# EAGLE design motherboard (EAGLE 5.10)
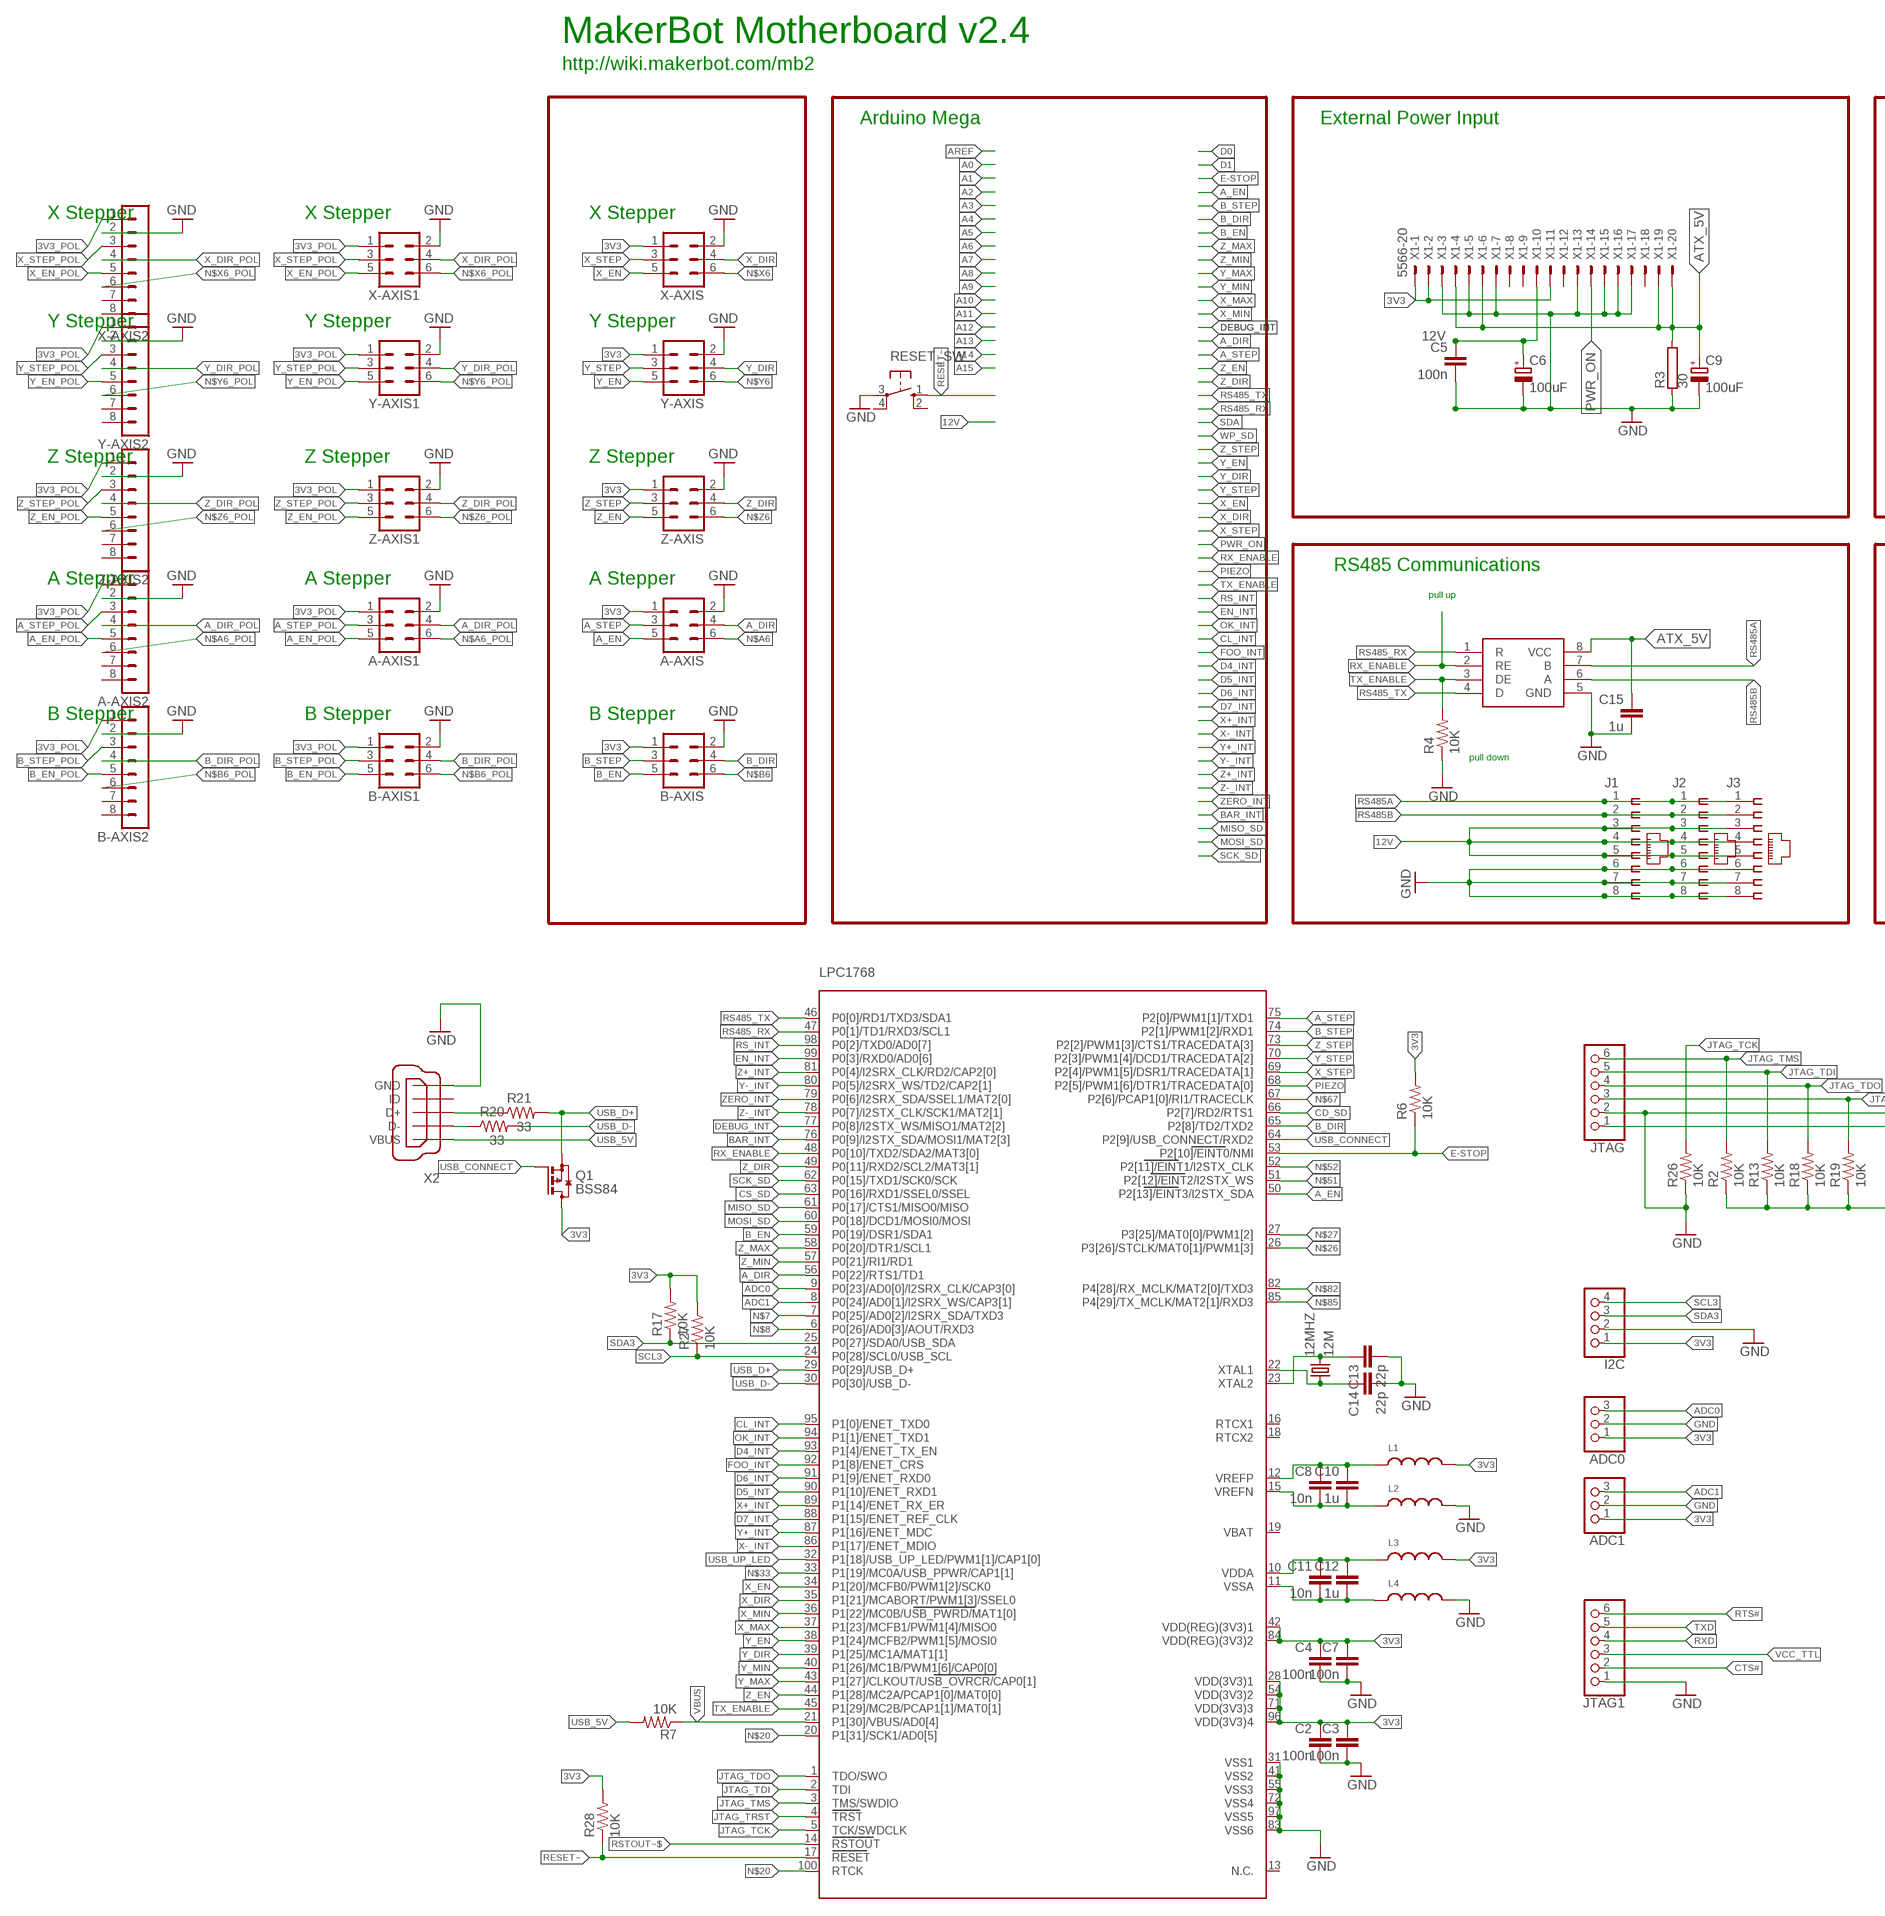
[diagram p0: schematic, sheet 1, part 1 of 2]
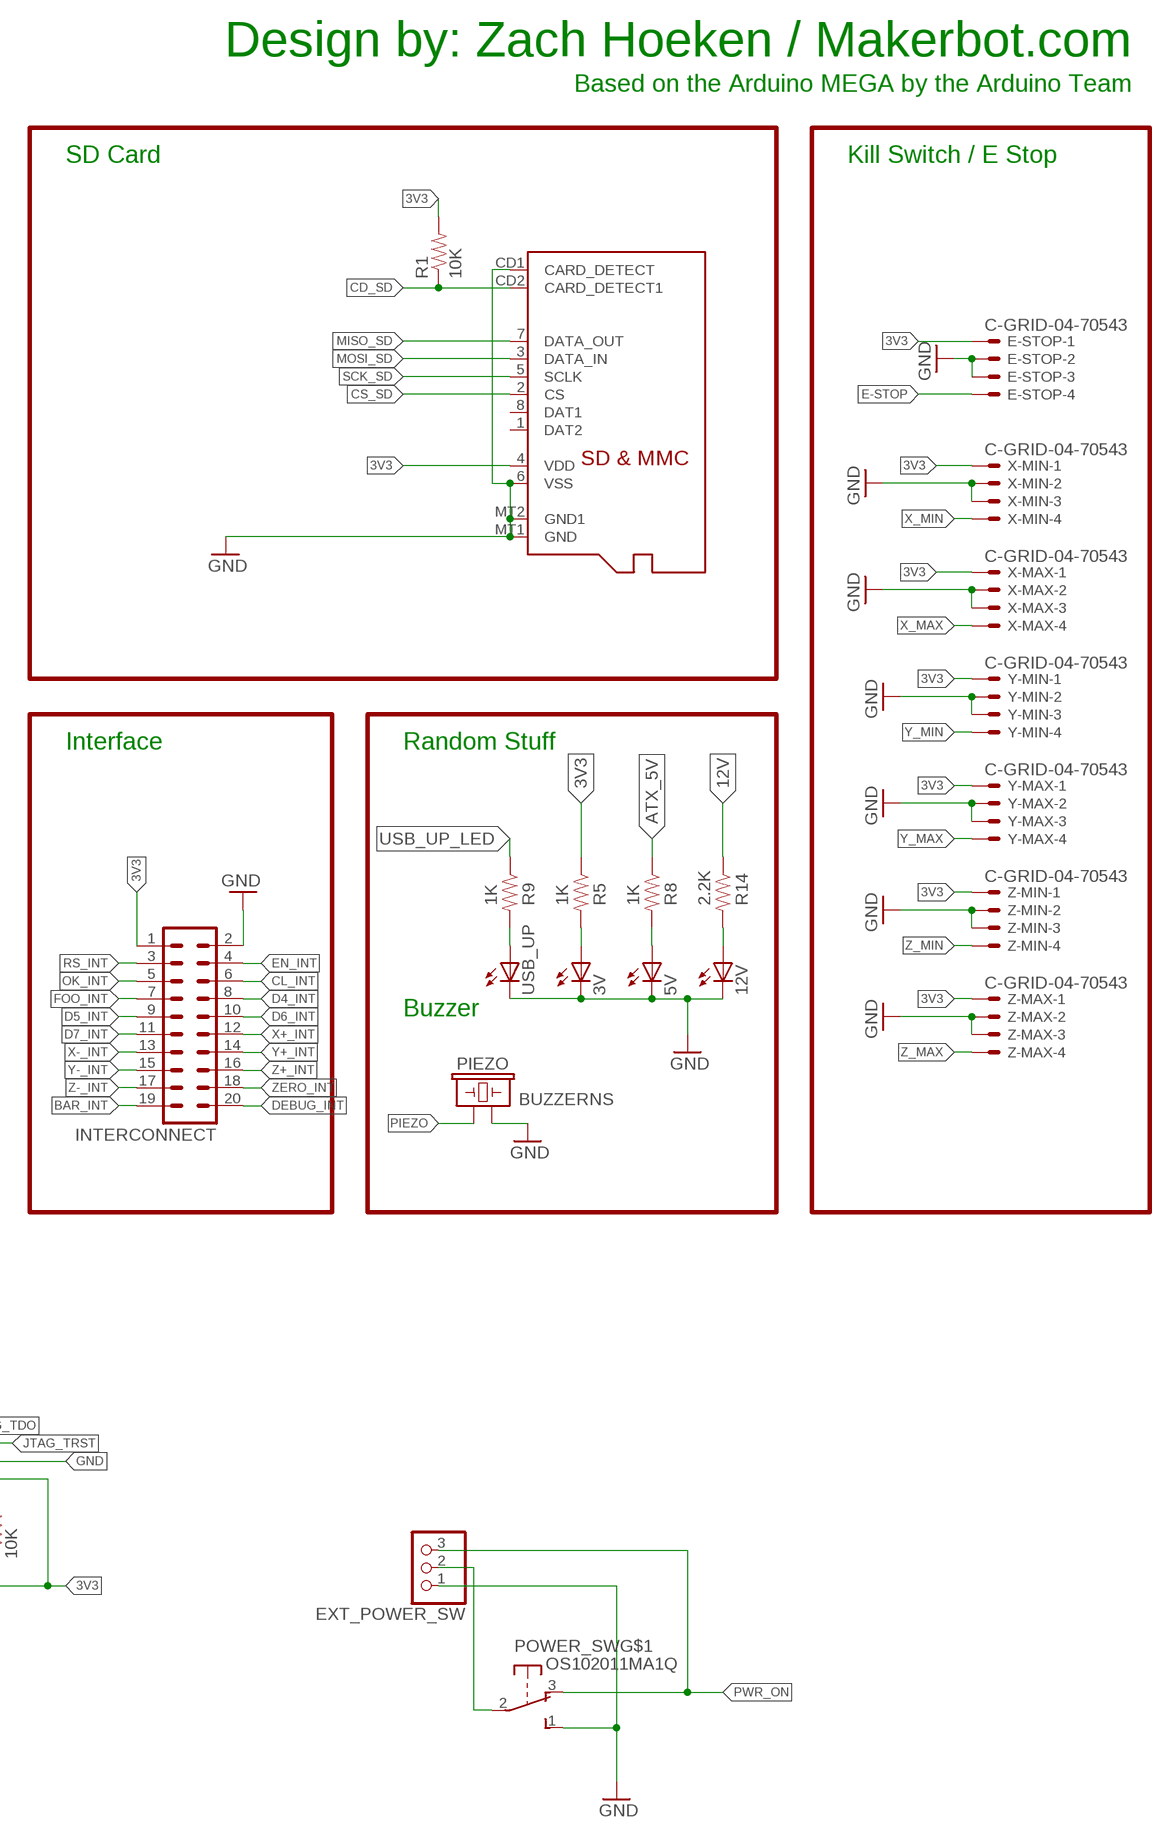
[diagram p1: schematic, sheet 1, part 2 of 2]

## Parts
3V  LED0805  [LED-0805]
5V  LED0805  [LED-0805]
12MHZ  12M  CRYSTALHC49U-V  [HC49U-V]
12V  LED0805  [LED-0805]
A-AXIS  MA03-2  [MA03-2]
A-AXIS1  MA03-2  [MA03-2]
A-AXIS2  MA08-1  [MA08-1]
ADC0  HEADER-1X3ROUND  [1X03_ROUND]
ADC1  HEADER-1X3ROUND  [1X03_ROUND]
B-AXIS  MA03-2  [MA03-2]
B-AXIS1  MA03-2  [MA03-2]
B-AXIS2  MA08-1  [MA08-1]
C2  100n  CAP0805  [0805]
C3  100n  CAP0805  [0805]
C4  100n  CAP0805  [0805]
C5  100n  CAP0805  [0805]
C6  100uF  CPOL-EUE2.5-5  [E2,5-5]
C7  100n  CAP0805  [0805]
C8  10n  CAP0805  [0805]
C9  100uF  CPOL-EUE2.5-5  [E2,5-5]
C10  1u  CAP0805  [0805]
C11  10n  CAP0805  [0805]
C12  1u  CAP0805  [0805]
C13  22p  CAP0805  [0805]
C14  22p  CAP0805  [0805]
C15  1u  CAP0805  [0805]
E-STOP  C-GRID-04-70543  [70543-04]
EXT_POWER_SW  HEADER-1X3ROUND  [1X03_ROUND]
I2C  HEADER-1X4ROUND  [1X04_ROUND]
INTERCONNECT  MA10-2  [MA10-2]
J1  556416-1  [556416-1]
J2  556416-1  [556416-1]
J3  556416-1  [556416-1]
JTAG  HEADER-1X6ROUND  [1X06_ROUND]
JTAG1  HEADER-1X6ROUND  [1X06_ROUND]
L1  INDUCTOR0603  [0603]
L2  INDUCTOR0603  [0603]
L3  INDUCTOR0603  [0603]
L4  INDUCTOR0603  [0603]
LPC1768  LPC1768  [LQFP100]
MICRO_SD  MICROSD  [MICROSD]
PIEZO  BUZZERNS  [BUZZER-12MM-NS]
POWER_SW  OS102011MA1Q  [OS102011MA1Q]
Q1  BSS84  [SOT23]
R1  10K  RESISTOR  [0805]
R2  10K  RESISTOR  [0805]
R3  30  RKH208-8R  [KH208R-8]
R4  10K  RESISTOR  [0805]
R5  1K  RESISTOR  [0805]
R6  10K  RESISTOR  [0805]
R7  10K  RESISTOR  [0805]
R8  1K  RESISTOR  [0805]
R9  1K  RESISTOR  [0805]
R13  10K  RESISTOR  [0805]
R14  2.2K  RESISTOR  [0805]
R17  10K  RESISTOR  [0805]
R18  10K  RESISTOR  [0805]
R19  10K  RESISTOR  [0805]
R20  33  RESISTOR  [0805]
R21  33  RESISTOR  [0805]
R26  10K  RESISTOR  [0805]
R27  10K  RESISTOR  [0805]
R28  10K  RESISTOR  [0805]
RESET_SW  10-XX  [B3F-10XX]
RS244  SN75176ASOIC  [SO08]
USB_UP  LED0805  [LED-0805]
X1  5566-20  [5566-20]
X2  MINI-USB_SHIELD5P2-32005-601  [32005-601]
X-AXIS  MA03-2  [MA03-2]
X-AXIS1  MA03-2  [MA03-2]
X-AXIS2  MA08-1  [MA08-1]
X-MAX  C-GRID-04-70543  [70543-04]
X-MIN  C-GRID-04-70543  [70543-04]
Y-AXIS  MA03-2  [MA03-2]
Y-AXIS1  MA03-2  [MA03-2]
Y-AXIS2  MA08-1  [MA08-1]
Y-MAX  C-GRID-04-70543  [70543-04]
Y-MIN  C-GRID-04-70543  [70543-04]
Z-AXIS  MA03-2  [MA03-2]
Z-AXIS1  MA03-2  [MA03-2]
Z-AXIS2  MA08-1  [MA08-1]
Z-MAX  C-GRID-04-70543  [70543-04]
Z-MIN  C-GRID-04-70543  [70543-04]

## Nets
3V3: A-AXIS.1 ADC0.1 ADC1.1 B-AXIS.1 C2.1 C3.1 C4.1 C7.1 E-STOP.1 I2C.1 INTERCONNECT.1 JTAG.1 L1.2 L3.2 LPC1768.28(VDD(3V3)1) LPC1768.42(VDD(REG)(3V3)1) LPC1768.54(VDD(3V3)2) LPC1768.71(VDD(3V3)3) LPC1768.84(VDD(REG)(3V3)2) LPC1768.96(VDD(3V3)4) MICRO_SD.4(VDD) Q1.3(D) R1.2 R2.1 R5.1 R6.2 R13.1 R17.2 R18.1 R19.1 R27.2 R28.2 X1.1 X1.2 X1.11 X-AXIS.1 X-MAX.1 X-MIN.1 Y-AXIS.1 Y-MAX.1 Y-MIN.1 Z-AXIS.1 Z-MAX.1 Z-MIN.1
3V3_POL: A-AXIS1.1 A-AXIS2.1 B-AXIS1.1 B-AXIS2.1 X-AXIS1.1 X-AXIS2.1 Y-AXIS1.1 Y-AXIS2.1 Z-AXIS1.1 Z-AXIS2.1
12V [12v]: C5.1 C6.+ J1.3 J1.4 J1.5 J2.3 J2.4 J2.5 J3.3 J3.4 J3.5 R14.1 X1.10
A_DIR: A-AXIS.4 LPC1768.56(P0[22]/RTS1/TD1)
A_DIR_POL: A-AXIS1.4 A-AXIS2.4
A_EN: A-AXIS.5 LPC1768.50(P2[13]/EINT3/I2STX_SDA)
A_EN_POL: A-AXIS1.5 A-AXIS2.5
A_STEP: A-AXIS.3 LPC1768.75(P2[0]/PWM1[1]/TXD1)
A_STEP_POL: A-AXIS1.3 A-AXIS2.3
ADC0: ADC0.3 LPC1768.9(P0[23]/AD0[0]/I2SRX_CLK/CAP3[0])
ADC1: ADC1.3 LPC1768.8(P0[24]/AD0[1]/I2SRX_WS/CAP3[1])
ATX_5V [power]: C9.+ C15.1 R3.2 R8.1 RS244.8(VCC) X1.4 X1.6 X1.19 X1.20
B_DIR: B-AXIS.4 LPC1768.65(P2[8]/TD2/TXD2)
B_DIR_POL: B-AXIS1.4 B-AXIS2.4
B_EN: B-AXIS.5 LPC1768.59(P0[19]/DSR1/SDA1)
B_EN_POL: B-AXIS1.5 B-AXIS2.5
B_STEP: B-AXIS.3 LPC1768.74(P2[1]/PWM1[2]/RXD1)
B_STEP_POL: B-AXIS1.3 B-AXIS2.3
BAR_INT: INTERCONNECT.19 LPC1768.76(P0[9]/I2STX_SDA/MOSI1/MAT2[3])
CD_SD: LPC1768.66(P2[7]/RD2/RTS1) MICRO_SD.CD2(CARD_DETECT1) R1.1
CL_INT: INTERCONNECT.6 LPC1768.95(P1[0]/ENET_TXD0)
CS_SD: LPC1768.63(P0[16]/RXD1/SSEL0/SSEL) MICRO_SD.2(CS)
CTS#: JTAG1.2
D4_INT: INTERCONNECT.8 LPC1768.93(P1[4]/ENET_TX_EN)
D5_INT: INTERCONNECT.9 LPC1768.90(P1[10]/ENET_RXD1)
D6_INT: INTERCONNECT.10 LPC1768.91(P1[9]/ENET_RXD0)
D7_INT: INTERCONNECT.11 LPC1768.88(P1[15]/ENET_REF_CLK)
DEBUG_INT: INTERCONNECT.20 LPC1768.77(P0[8]/I2STX_WS/MISO1/MAT2[2])
E-STOP: E-STOP.4 LPC1768.53(P2[10]/EINT0/NMI) R6.1
EN_INT: INTERCONNECT.4 LPC1768.99(P0[3]/RXD0/AD0[6])
FOO_INT: INTERCONNECT.7 LPC1768.92(P1[8]/ENET_CRS)
GND [gnd]: 3V.C 5V.C 12V.C A-AXIS.2 ADC0.2 ADC1.2 B-AXIS.2 C2.2 C3.2 C4.2 C5.2 C6.- C7.2 C9.- C13.2 C14.2 C15.2 E-STOP.2 E-STOP.3 EXT_POWER_SW.1 I2C.2 INTERCONNECT.2 J1.6 J1.7 J1.8 J2.6 J2.7 J2.8 J3.6 J3.7 J3.8 JTAG1.1 JTAG.2 L2.2 L4.2 LPC1768.31(VSS1) LPC1768.41(VSS2) LPC1768.55(VSS3) LPC1768.72(VSS4) LPC1768.83(VSS6) LPC1768.97(VSS5) MICRO_SD.6(VSS) MICRO_SD.CD1(CARD_DETECT) MICRO_SD.MT1(GND) MICRO_SD.MT2(GND1) PIEZO.- POWER_SW.1(S) R3.1 R4.1 R26.1 RESET_SW.3(P) RS244.5(GND) USB_UP.C X1.3 X1.5 X1.7 X1.13 X1.15 X1.16 X1.17 X2.5(GND) X-AXIS.2 X-MAX.2 X-MAX.3 X-MIN.2 X-MIN.3 Y-AXIS.2 Y-MAX.2 Y-MAX.3 Y-MIN.2 Y-MIN.3 Z-AXIS.2 Z-MAX.2 Z-MAX.3 Z-MIN.2 Z-MIN.3
GND_POL [gnd]: A-AXIS1.2 A-AXIS2.2 B-AXIS1.2 B-AXIS2.2 X-AXIS1.2 X-AXIS2.2 Y-AXIS1.2 Y-AXIS2.2 Z-AXIS1.2 Z-AXIS2.2 ; supply symbol labelled GND
JTAG_TCK: LPC1768.5(TCK/SWDCLK) R26.2
JTAG_TDI: JTAG.5 LPC1768.2(TDI) R13.2
JTAG_TDO: JTAG.4 LPC1768.1(TDO/SWO) R18.2
JTAG_TMS: JTAG.6 LPC1768.3(TMS/SWDIO) R2.2
JTAG_TRST: JTAG.3 LPC1768.4(TRST) R19.2
MISO_SD: LPC1768.61(P0[17]/CTS1/MISO0/MISO) MICRO_SD.7(DATA_OUT)
MOSI_SD: LPC1768.60(P0[18]/DCD1/MOSI0/MOSI) MICRO_SD.3(DATA_IN)
N$1: 3V.A R5.2
N$2: R9.2 USB_UP.A
N$3: 5V.A R8.2
N$4: EXT_POWER_SW.2 POWER_SW.2(P)
N$7: LPC1768.7(P0[25]/AD0[2]/I2SRX_SDA/TXD3)
N$8: LPC1768.6(P0[26]/AD0[3]/AOUT/RXD3)
N$10: 12V.A R14.2
N$20: LPC1768.20(P1[31]/SCK1/AD0[5]) LPC1768.100(RTCK)
N$26: LPC1768.26(P3[26]/STCLK/MAT0[1]/PWM1[3])
N$27: LPC1768.27(P3[25]/MAT0[0]/PWM1[2])
N$31: C8.1 C10.1 L1.1 LPC1768.12(VREFP)
N$32: C8.2 C10.2 L2.1 LPC1768.15(VREFN)
N$33: LPC1768.33(P1[19]/MC0A/USB_PPWR/CAP1[1])
N$35: C11.1 C12.1 L3.1 LPC1768.10(VDDA)
N$38: C11.2 C12.2 L4.1 LPC1768.11(VSSA)
N$51: LPC1768.51(P2[12]/EINT2/I2STX_WS)
N$52: LPC1768.52(P2[11]/EINT1/I2STX_CLK)
N$67: LPC1768.67(P2[6]/PCAP1[0]/RI1/TRACECLK)
N$82: LPC1768.82(P4[28]/RX_MCLK/MAT2[0]/TXD3)
N$85: LPC1768.85(P4[29]/TX_MCLK/MAT2[1]/RXD3)
N$A6: A-AXIS.6
N$A6_POL: A-AXIS1.6 A-AXIS2.6
N$B6: B-AXIS.6
N$B6_POL: B-AXIS1.6 B-AXIS2.6
N$X6: X-AXIS.6
N$X6_POL: X-AXIS1.6 X-AXIS2.6
N$Y6: Y-AXIS.6
N$Y6_POL: Y-AXIS1.6 Y-AXIS2.6
N$Z6: Z-AXIS.6
N$Z6_POL: Z-AXIS1.6 Z-AXIS2.6
OK_INT: INTERCONNECT.5 LPC1768.94(P1[1]/ENET_TXD1)
PIEZO: LPC1768.68(P2[5]/PWM1[6]/DTR1/TRACEDATA[0]) PIEZO.+
PWR_ON: EXT_POWER_SW.3 POWER_SW.3(O) X1.14
RESET~: LPC1768.17(RESET) R28.1 RESET_SW.1(S)
RS485_RX: LPC1768.47(P0[1]/TD1/RXD3/SCL1) RS244.1(R)
RS485_TX: LPC1768.46(P0[0]/RD1/TXD3/SDA1) RS244.4(D)
RS485A: J1.1 J2.1 J3.1 RS244.7(B)
RS485B: J1.2 J2.2 J3.2 RS244.6(A)
RS_INT: INTERCONNECT.3 LPC1768.98(P0[2]/TXD0/AD0[7])
RSTOUT~$: LPC1768.14(RSTOUT)
RTS#: JTAG1.6
RX_ENABLE: LPC1768.48(P0[10]/TXD2/SDA2/MAT3[0]) RS244.2(RE)
RXD: JTAG1.4
SCK_SD: LPC1768.62(P0[15]/TXD1/SCK0/SCK) MICRO_SD.5(SCLK)
SCL3: I2C.4 LPC1768.24(P0[28]/SCL0/USB_SCL) R27.1
SDA3: I2C.3 LPC1768.25(P0[27]/SDA0/USB_SDA) R17.1
TX_ENABLE: LPC1768.45(P1[29]/MC2B/PCAP1[1]/MAT0[1]) R4.2 RS244.3(DE)
TXD: JTAG1.5
USB_5V [12v]: R7.2 X2.1(VBUS)
USB_CONNECT: LPC1768.64(P2[9]/USB_CONNECT/RXD2) Q1.1(G)
USB_D+: LPC1768.29(P0[29]/USB_D+) Q1.2(S) R21.2
USB_D+_CON: R21.1 X2.3(D+)
USB_D-: LPC1768.30(P0[30]/USB_D-) R20.2
USB_D-_CON: R20.1 X2.2(D-)
USB_UP_LED: LPC1768.32(P1[18]/USB_UP_LED/PWM1[1]/CAP1[0]) R9.1
VBUS: LPC1768.21(P1[30]/VBUS/AD0[4]) R7.1
VCC_TTL: JTAG1.3
X+_INT: INTERCONNECT.12 LPC1768.89(P1[14]/ENET_RX_ER)
X-_INT: INTERCONNECT.13 LPC1768.86(P1[17]/ENET_MDIO)
X_DIR: LPC1768.35(P1[21]/MCABORT/PWM1[3]/SSEL0) X-AXIS.4
X_DIR_POL: X-AXIS1.4 X-AXIS2.4
X_EN: LPC1768.34(P1[20]/MCFB0/PWM1[2]/SCK0) X-AXIS.5
X_EN_POL: X-AXIS1.5 X-AXIS2.5
X_MAX: LPC1768.37(P1[23]/MCFB1/PWM1[4]/MISO0) X-MAX.4
X_MIN: LPC1768.36(P1[22]/MC0B/USB_PWRD/MAT1[0]) X-MIN.4
X_STEP: LPC1768.69(P2[4]/PWM1[5]/DSR1/TRACEDATA[1]) X-AXIS.3
X_STEP_POL: X-AXIS1.3 X-AXIS2.3
XTAL1: 12MHZ.1 C14.1 LPC1768.22(XTAL1)
XTAL2: 12MHZ.2 C13.1 LPC1768.23(XTAL2)
Y+_INT: INTERCONNECT.14 LPC1768.87(P1[16]/ENET_MDC)
Y-_INT: INTERCONNECT.15 LPC1768.80(P0[5]/I2SRX_WS/TD2/CAP2[1])
Y_DIR: LPC1768.39(P1[25]/MC1A/MAT1[1]) Y-AXIS.4
Y_DIR_POL: Y-AXIS1.4 Y-AXIS2.4
Y_EN: LPC1768.38(P1[24]/MCFB2/PWM1[5]/MOSI0) Y-AXIS.5
Y_EN_POL: Y-AXIS1.5 Y-AXIS2.5
Y_MAX: LPC1768.43(P1[27]/CLKOUT/USB_OVRCR/CAP0[1]) Y-MAX.4
Y_MIN: LPC1768.40(P1[26]/MC1B/PWM1[6]/CAP0[0]) Y-MIN.4
Y_STEP: LPC1768.70(P2[3]/PWM1[4]/DCD1/TRACEDATA[2]) Y-AXIS.3
Y_STEP_POL: Y-AXIS1.3 Y-AXIS2.3
Z+_INT: INTERCONNECT.16 LPC1768.81(P0[4]/I2SRX_CLK/RD2/CAP2[0])
Z-_INT: INTERCONNECT.17 LPC1768.78(P0[7]/I2STX_CLK/SCK1/MAT2[1])
Z_DIR: LPC1768.49(P0[11]/RXD2/SCL2/MAT3[1]) Z-AXIS.4
Z_DIR_POL: Z-AXIS1.4 Z-AXIS2.4
Z_EN: LPC1768.44(P1[28]/MC2A/PCAP1[0]/MAT0[0]) Z-AXIS.5
Z_EN_POL: Z-AXIS1.5 Z-AXIS2.5
Z_MAX: LPC1768.58(P0[20]/DTR1/SCL1) Z-MAX.4
Z_MIN: LPC1768.57(P0[21]/RI1/RD1) Z-MIN.4
Z_STEP: LPC1768.73(P2[2]/PWM1[3]/CTS1/TRACEDATA[3]) Z-AXIS.3
Z_STEP_POL: Z-AXIS1.3 Z-AXIS2.3
ZERO_INT: INTERCONNECT.18 LPC1768.79(P0[6]/I2SRX_SDA/SSEL1/MAT2[0])
Unconnected: A-AXIS2.7 A-AXIS2.8 B-AXIS2.7 B-AXIS2.8 LPC1768.13(N.C.) LPC1768.16(RTCX1) LPC1768.18(RTCX2) LPC1768.19(VBAT) MICRO_SD.1(DAT2) MICRO_SD.8(DAT1) POWER_SW.MT1(MT) POWER_SW.MT2(MT) RESET_SW.2(S1) RESET_SW.4(P1) X1.8 X1.9 X1.12 X1.18 X2.4(ID) X2.M1(S1) X2.M2(S2) X-AXIS2.7 X-AXIS2.8 Y-AXIS2.7 Y-AXIS2.8 Z-AXIS2.7 Z-AXIS2.8

## Notes on the sheet
- Design by: Zach Hoeken / Makerbot.com
- MakerBot Motherboard v2.4
- Based on the Arduino MEGA by the Arduino Team
- http://wiki.makerbot.com/mb2
- Arduino Mega | External Power Input | SD Card | Kill Switch / E Stop
- X Stepper | X Stepper | X Stepper
- Y Stepper | Y Stepper | Y Stepper
- Z Stepper | Z Stepper | Z Stepper
- RS485 Communications | Interface | Random Stuff
- A Stepper | A Stepper | A Stepper
- pull up
- B Stepper | B Stepper | B Stepper
- pull down
- Buzzer

## Library data of the parts
3V 5V 12V USB_UP = SparkFun:LED: LEDs Standard schematic elements and footprints for 5mm, 3mm, 1206, and 0603 sized LEDs. 5mm - Spark Fun Electronics SKU : COM-00529 (and others)
12MHZ = crystal:CRYSTAL: CRYSTAL; OC_FARNELL: 1666969; OC_NEWARK: unknown
A-AXIS A-AXIS1 B-AXIS B-AXIS1 X-AXIS X-AXIS1 Y-AXIS Y-AXIS1 Z-AXIS Z-AXIS1 = con-lstb:MA03-2: PIN HEADER; OC_FARNELL: unknown; OC_NEWARK: unknown
A-AXIS2 B-AXIS2 X-AXIS2 Y-AXIS2 Z-AXIS2 = con-lstb:MA08-1: PIN HEADER; OC_FARNELL: unknown; OC_NEWARK: unknown
ADC0 ADC1 EXT_POWER_SW = microbuilder:HEADER-1X3: PIN HEADER
C2-C5 C7 C8 C10-C15 = SparkFun:CAP: Capacitor Standard 0603 ceramic capacitor, and 0.1" leaded capacitor.
C6 C9 = resistor:CPOL-EU: POLARIZED CAPACITOR, European symbol
E-STOP X-MAX X-MIN Y-MAX Y-MIN Z-MAX Z-MIN = con-molex:C-GRID-04: CONNECTOR wire to board 2.54 mm (0.100") pitch header; OC_FARNELL: unknown; OC_NEWARK: unknown
I2C = microbuilder:HEADER-1X4: PIN HEADER
INTERCONNECT = con-lstb:MA10-2: PIN HEADER; OC_FARNELL: unknown; OC_NEWARK: unknown
J1-J3 = con-amp:556416-1: AMP connector; MF: TYCO ELECTRONICS; MPN: 5556416-1; OC_FARNELL: 1087508; OC_NEWARK: 42K7302
JTAG JTAG1 = microbuilder:HEADER-1X6: PIN HEADER
L1-L4 = microbuilder:INDUCTOR: Inductors 0603: 10nH Ceramic Inductor - microwire antenna/RF (Digikey: 712-1434-2-ND) 0805: 560nH Ceramic Inductor - RF (Digikey: 553-1047-1-ND) 1007 (2518 Metric) SMT: 10µH 10% 250mOhm 820mA 1007 Inductor (Digikey: 587-2189-1-ND) 22µH 10% 500mOhm 580mA 1007 Inductor (Digikey: 587-2190-1-ND) 47µH 10% 950mOhm 420mA 1007 Inductor (Digikey: 587-2191-1-ND) 47µH 5% 100mOhm 1A 1008 Inductor (Digikey: 732-1816-1-ND)
LPC1768 = microbuilder:LPC1768: LPC1768 100 MHz 32-bit ARM Cortex-M3 based microcontroller featuring a high level of integration and low power consumption. 512 kB Flash, 64 kB SRAM, USB Device/Host/OTG, Ethernet, CAN, I2S, 10-bit DAC Digikey: 568-4796-ND
MICRO_SD = adafruit:MICROSD: Micro-SD / Transflash card holder with SPI pinout For the 3M # 2908-05WB-MG and/or 4UCON #19656 push-push type
PIEZO = SparkFun:BUZZER: Buzzer 12mm Spark Fun Electronics SKU : Comp-Buzzer
POWER_SW = adafruit:OS102011MA1Q: OS10201MA1Q through-hole right angle switch http://www.ladyada.net/library/eagle
Q1 = transistor-small-signal:BSS84: P-CHANNEL MOS FET
R1 R2 R4-R9 R13 R14 R17-R21 R26-R28 = SparkFun:RESISTOR: Resistor Basic schematic elements and footprints for 0603, 1206, and PTH 1/10th watt (small) resistors.
R3 = resistor-power:R: Power Resitor
RESET_SW = switch-omron:10-XX: OMRON SWITCH; MPN: B3F-1000; OC_FARNELL: 176432; OC_NEWARK: 36M3542
RS244 = reprap:SN75176A
X1 = con-molex:5566-20: Mini FIT connector 20 pol ATX PC-Motherboard Power connector Source: http://www.molex.com; OC_FARNELL: unknown; OC_NEWARK: unknown
X2 = con-cypressindustries:MINI-USB_SHIELD5P2-: MINI USB-B R/A DIP 5pol. Source: www.cypressindustries.com; OC_FARNELL: unknown; OC_NEWARK: unknown

## Net classes
0 default: width 0.203 mm, drill 0.508 mm, clearance 0.203 mm
1 power: width 0.508 mm, drill 0.508 mm, clearance 0.203 mm
2 gnd: width 0.305 mm, drill 0.508 mm, clearance 0.203 mm
3 12v: width 1.016 mm, drill 0.711 mm, clearance 0.203 mm

## Board
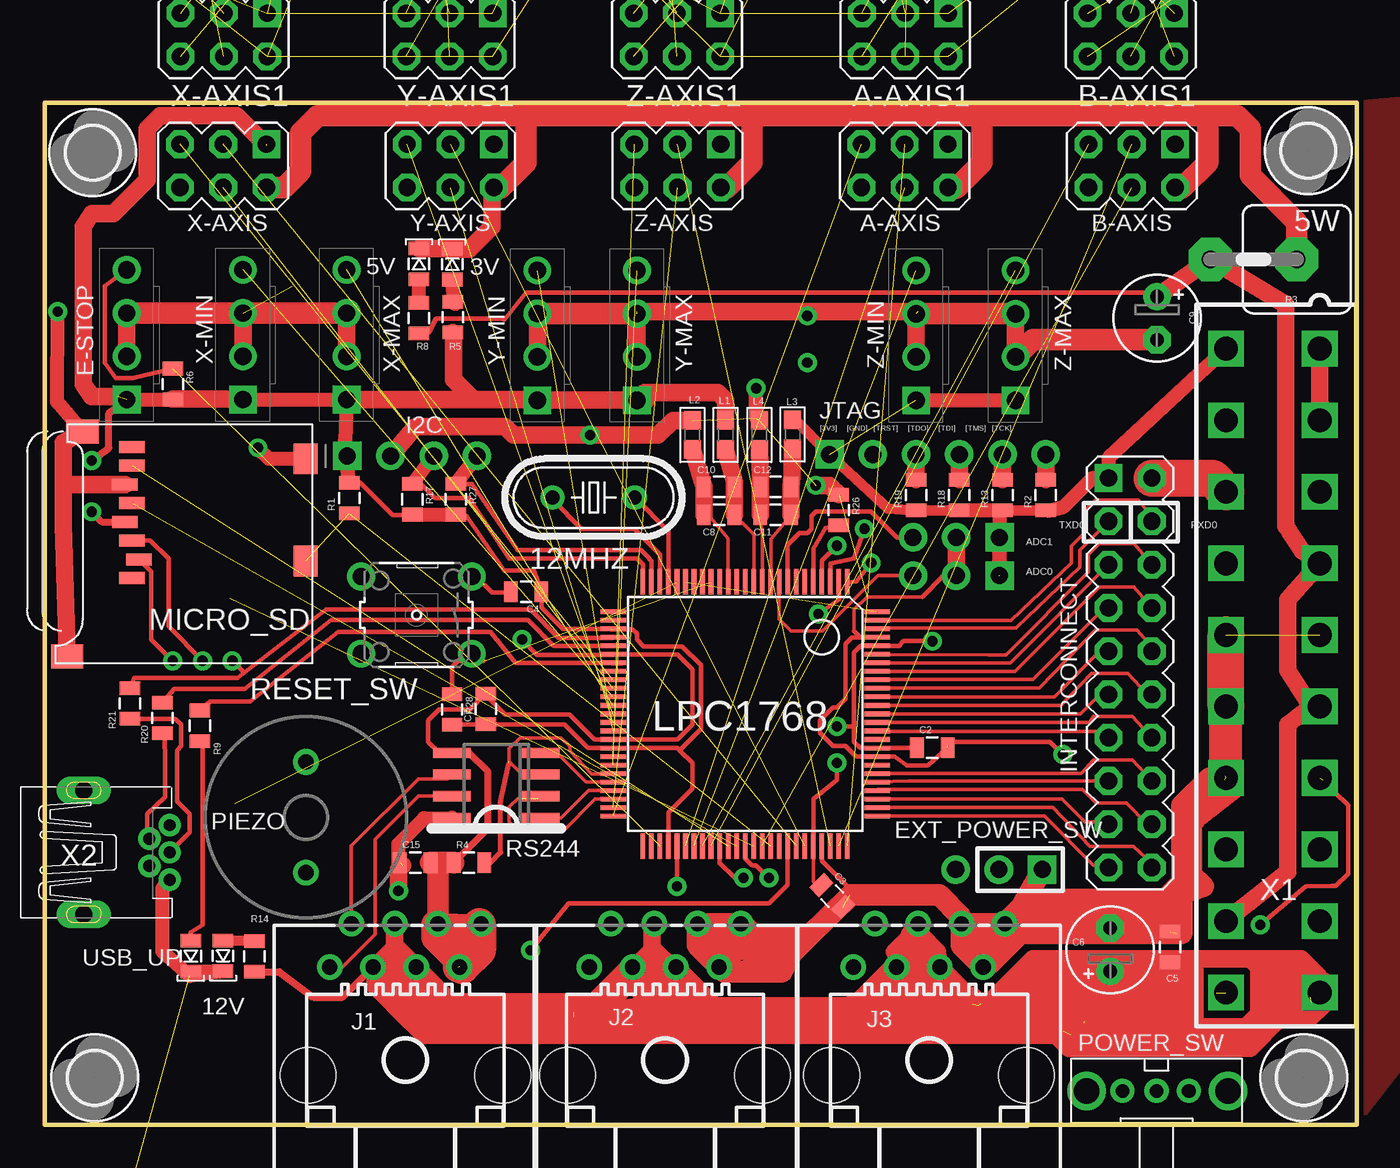
[diagram p2: board, top side]
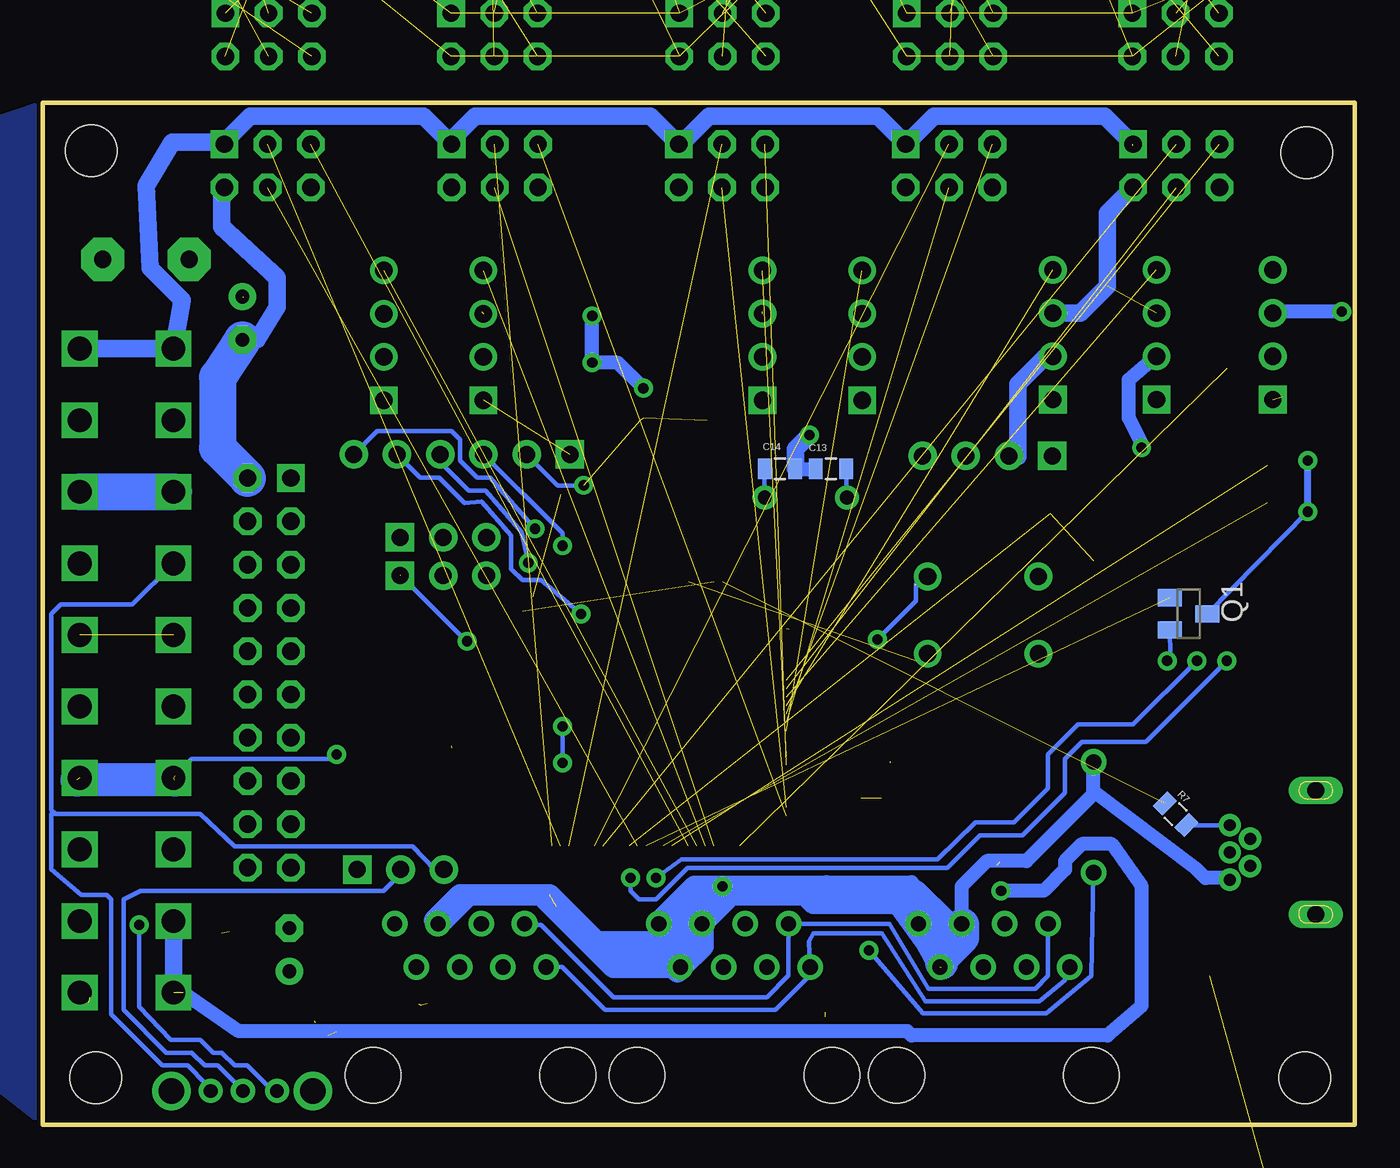
[diagram p3: board, bottom side, seen from below]

Size 77 x 60 mm. Coordinates in mm from the lower left corner, seen from the top.
Outline: 0,60 77,60 77,0 0,0 0,60
Copper layers (1*16): Top 0.035mm / dielectric 1.53mm / Bottom 0.035mm
Design rules "SparkFun *": minimum track width 8mil, minimum drill 0.4mm, track to track 8mil, track to pad 8mil, pad to pad 8mil, via to via 8mil, smd to smd 8mil, copper to edge 10mil, drill to drill 8mil, minimum pad ring 12mil, minimum via ring 10mil, stop-mask expansion 4mil, vias tented up to drill 25mil, thermal gap 10mil

### Footprints (pad centres in the part's own frame; a part is rotated, then mirrored left to right if it is on the bottom)
LED-0805 = smd 1.2 x 0.8: A 0,-0.9; C 0,0.9
HC49U-V = drill 0.813 round: 1 -2.413,0; 2 2.413,0
MA03-2 = drill 1.016 square: 1 -2.54,-1.27 | drill 1.016 octagon: 2 -2.54,1.27; 3 0,-1.27; 4 0,1.27; 5 2.54,-1.27; 6 2.54,1.27
MA08-1 = drill 1.016 long: 1 -8.89,0; 2 -6.35,0; 3 -3.81,0; 4 -1.27,0; 5 1.27,0; 6 3.81,0; 7 6.35,0; 8 8.89,0
1X03_ROUND = drill 1 pad 1.676 square: 1 -2.54,0 | drill 1 pad 1.676 round: 2 0,0; 3 2.54,0
0805 = smd 0.8 x 1.2: 1 -0.9,0; 2 0.9,0
E2,5-5 = drill 0.813 pad 1.6 round: + -1.27,0 | drill 0.813 pad 1.6 octagon: - 1.27,0
70543-04 = drill 1.016 square: 1 -3.81,0 | drill 1.016 round: 2 -1.27,0; 3 1.27,0; 4 3.81,0
1X04_ROUND = drill 1 pad 1.676 square: 1 -3.81,0 | drill 1 pad 1.676 round: 2 -1.27,0; 3 1.27,0; 4 3.81,0
MA10-2 = drill 1.016 square: 1 -11.43,-1.27 | drill 1.016 octagon: 2 -11.43,1.27; 3 -8.89,-1.27; 4 -8.89,1.27; 5 -6.35,-1.27; 6 -6.35,1.27; 7 -3.81,-1.27; 8 -3.81,1.27; 9 -1.27,-1.27; 10 -1.27,1.27; 11 1.27,-1.27; 12 1.27,1.27; 13 3.81,-1.27; 14 3.81,1.27; 15 6.35,-1.27; 16 6.35,1.27; 17 8.89,-1.27; 18 8.89,1.27; 19 11.43,-1.27; 20 11.43,1.27
556416-1 = drill 0.889 round: 1 -4.445,5.461; 2 -3.175,8.001; 3 -1.905,5.461; 4 -0.635,8.001; 5 0.635,5.461; 6 1.905,8.001; 7 3.175,5.461; 8 4.445,8.001 | hole 3.251: -5.715,-0.889; 5.715,-0.889
1X06_ROUND = drill 1 pad 1.676 square: 1 -6.35,0 | drill 1 pad 1.676 round: 2 -3.81,0; 3 -1.27,0; 4 1.27,0; 5 3.81,0; 6 6.35,0
0603 = smd 1.1 x 1: 1 -0.85,0; 2 0.85,0
LQFP100 = smd 0.27 x 1.5: 1 -6,-7.75; 2 -5.5,-7.75; 3 -5,-7.75; 4 -4.5,-7.75; 5 -4,-7.75; 6 -3.5,-7.75; 7 -3,-7.75; 8 -2.5,-7.75; 9 -2,-7.75; 10 -1.5,-7.75; 11 -1,-7.75; 12 -0.5,-7.75; 13 0,-7.75; 14 0.5,-7.75; 15 1,-7.75; 16 1.5,-7.75; 17 2,-7.75; 18 2.5,-7.75; 19 3,-7.75; 20 3.5,-7.75; 21 4,-7.75; 22 4.5,-7.75; 23 5,-7.75; 24 5.5,-7.75; 25 6,-7.75; 51 6,7.75; 52 5.5,7.75; 53 5,7.75; 54 4.5,7.75; 55 4,7.75; 56 3.5,7.75; 57 3,7.75; 58 2.5,7.75; 59 2,7.75; 60 1.5,7.75; 61 1,7.75; 62 0.5,7.75; 63 0,7.75; 64 -0.5,7.75; 65 -1,7.75; 66 -1.5,7.75; 67 -2,7.75; 68 -2.5,7.75; 69 -3,7.75; 70 -3.5,7.75; 71 -4,7.75; 72 -4.5,7.75; 73 -5,7.75; 74 -5.5,7.75; 75 -6,7.75 | smd 1.5 x 0.27: 26 7.75,-6; 27 7.75,-5.5; 28 7.75,-5; 29 7.75,-4.5; 30 7.75,-4; 31 7.75,-3.5; 32 7.75,-3; 33 7.75,-2.5; 34 7.75,-2; 35 7.75,-1.5; 36 7.75,-1; 37 7.75,-0.5; 38 7.75,0; 39 7.75,0.5; 40 7.75,1; 41 7.75,1.5; 42 7.75,2; 43 7.75,2.5; 44 7.75,3; 45 7.75,3.5; 46 7.75,4; 47 7.75,4.5; 48 7.75,5; 49 7.75,5.5; 50 7.75,6; 76 -7.75,6; 77 -7.75,5.5; 78 -7.75,5; 79 -7.75,4.5; 80 -7.75,4; 81 -7.75,3.5; 82 -7.75,3; 83 -7.75,2.5; 84 -7.75,2; 85 -7.75,1.5; 86 -7.75,1; 87 -7.75,0.5; 88 -7.75,0; 89 -7.75,-0.5; 90 -7.75,-1; 91 -7.75,-1.5; 92 -7.75,-2; 93 -7.75,-2.5; 94 -7.75,-3; 95 -7.75,-3.5; 96 -7.75,-4; 97 -7.75,-4.5; 98 -7.75,-5; 99 -7.75,-5.5; 100 -7.75,-6
MICROSD = smd 0.7 x 1.5: 1 9,-10.64; 2 7.9,-10.24; 3 6.8,-10.64; 4 5.7,-11.04; 5 4.6,-10.64; 6 3.5,-11.04; 7 2.4,-10.64; 8 1.3,-10.64 | smd 1.8 x 1.4: CD1 2,-0.44; CD2 8,-0.44 | smd 1.4 x 1.9: MT1 0.4,-13.54; MT2 13.6,-14.44
BUZZER-12MM-NS = drill 0.9 round: + 3.25,0; - -3.25,0
OS102011MA1Q = drill 0.8 pad 1.422 round: 1 -2,0; 2 0,0; 3 1.9,0 | drill 1.5 pad 2.184 round: MT1 -4.1,0; MT2 4.2,0
SOT23 = smd 1 x 1.4: 1 -0.95,-1.1; 2 0.95,-1.1; 3 0,1.1
KH208R-8 = drill 1.016 pad 2.54 octagon: 1 -2.54,0; 2 2.54,0
B3F-10XX = drill 1.016 round: 1 -3.251,2.261; 2 3.251,2.261; 3 -3.251,-2.261; 4 3.251,-2.261
SO08 = smd 0.6 x 2.2: 1 -1.905,-2.6; 2 -0.635,-2.6; 3 0.635,-2.6; 4 1.905,-2.6; 5 1.905,2.6; 6 0.635,2.6; 7 -0.635,2.6; 8 -1.905,2.6
3,0 = hole 3: 0,0
5566-20 = drill 1.4 square: 1 18.9,-2.75; 2 14.7,-2.75; 3 10.5,-2.75; 4 6.3,-2.75; 5 2.1,-2.75; 6 -2.1,-2.75; 7 -6.3,-2.75; 8 -10.5,-2.75; 9 -14.7,-2.75; 10 -18.9,-2.75; 11 18.9,2.75; 12 14.7,2.75; 13 10.5,2.75; 14 6.3,2.75; 15 2.1,2.75; 16 -2.1,2.75; 17 -6.3,2.75; 18 -10.5,2.75; 19 -14.7,2.75; 20 -18.9,2.75
32005-601 = drill 0.7 pad 0.813 round: 1 2.825,1.6; 2 1.625,0.8; 3 2.825,0; 4 1.625,-0.8; 5 2.825,-1.6 | drill 1 pad 1.422 long: M1 -2.225,3.65; M2 -2.225,-3.65

### Placement (x,y rotation side)
3V  23.91,50.53 0 top
5V  21.96,50.55 0 top
12MHZ  32.21,36.83 180 top
12V  10.45,9.93 180 top
A-AXIS  50.47,56.3 180 top
A-AXIS1  50.5,64 180 top
A-AXIS2  52,75.25 0 top  (outside the outline)
ADC0  53.5,32.25 180 top
ADC1  53.5,34.5 180 top
B-AXIS  63.81,56.3 180 top
B-AXIS1  63.75,64 180 top
B-AXIS2  69.5,71 0 top  (outside the outline)
C2  52.09,22.14 0 top
C3  46.22,13.44 315 top
C4  28.24,31.29 180 top
C5  66.05,10.45 90 top
C6  62.53,10.28 90 top
C7  25.87,24.42 90 top
C8  39.58,35.81 180 top
C9  65.28,47.36 270 top
C10  39.58,37.47 180 top
C11  42.89,35.81 180 top
C12  42.89,37.47 180 top
C13  30.74,38.52 180 bottom
C14  33.73,38.52 0 bottom
C15  21.74,15.4 0 top
E-STOP  4.8,46.39 90 top
EXT_POWER_SW  56,15 180 top
I2C  21.55,39.27 0 top
INTERCONNECT  63.71,26.54 270 top
J1  21.16,3.81 0 top
J2  36.4,3.81 0 top
J3  51.9,3.81 0 top
JTAG  52.4,39.37 0 top
JTAG1  2.5,-35.5 0 top  (outside the outline)
L1  39.96,40.51 90 top
L2  38,40.51 90 top
L3  43.89,40.54 90 top
L4  41.94,40.51 90 top
LPC1768  41.1,24.13 180 top
MICRO_SD  15.75,41.11 270 top
PIEZO  15.32,18.06 270 top
POWER_SW  65.25,2 0 top
Q1  9.75,30 270 bottom
R1  17.86,36.8 90 top
R2  58.75,36.98 90 top
R3  70.95,50.82 180 top
R4  24.89,15.4 0 top
R5  23.94,47.42 90 top
R6  7.5,43.5 270 top
R7  10.5,18.25 315 bottom
R8  21.96,47.37 90 top
R9  9.11,23.44 270 top
R13  56.21,36.98 90 top
R14  12.3,9.9 90 top
R17  21.57,36.73 270 top
R18  53.67,36.98 90 top
R19  51.13,36.98 90 top
R20  6.9,23.9 90 top
R21  5,24.75 90 top
R26  46.6,36.1 270 top
R27  24.11,36.73 270 top
R28  23.9,24.39 270 top
RESET_SW  21.81,29.93 180 top
RS244  26.5,19.94 90 top
U$4  [3,0]  2.79,57.07 0 top
U$5  [3,0]  74.15,57.2 0 top
U$6  [3,0]  73.9,2.77 0 top
U$7  [3,0]  2.92,2.77 0 top
USB_UP  8.56,9.91 180 top
X1  72.08,26.67 90 top
X2  4.5,16 0 top
X-AXIS  10.47,56.3 180 top
X-AXIS1  10.5,64 180 top
X-AXIS2  10.25,70 0 top  (outside the outline)
X-MAX  17.71,46.39 90 top
X-MIN  11.62,46.39 90 top
Y-AXIS  23.8,56.3 180 top
Y-AXIS1  23.75,64 180 top
Y-AXIS2  24.5,75.25 0 top  (outside the outline)
Y-MAX  34.75,46.36 90 top
Y-MIN  28.91,46.36 90 top
Z-AXIS  37.14,56.3 180 top
Z-AXIS1  37.1,64 180 top
Z-AXIS2  37.75,70.75 0 top  (outside the outline)
Z-MAX  56.98,46.35 90 top
Z-MIN  51.13,46.35 90 top

### Tracks (layer width: path | path; a pad name or v marks a point on that pad's centre or on a via)
3V3  (via drill 0.6)  (5 unrouted)
  Top 0.203: LPC1768.71 45.1,14.28 C3.1
  Top 0.254: 43.93,41.49 L3.2 | R1.2 18.5,37.7 20.4,35.8 21.54,35.8 R17.2 | LPC1768.28 30.4,29.13 29.14,30.39 C4.1 28.7,32.55 26.95,32.55 24.75,35.75 R27.2 | C2.1 51.4,22.13 LPC1768.84 47.87,22.13 47.5,22.5 47.5,23.4 | 47.5,23.4 47.5,27.75 47.88,28.13 LPC1768.96 50.13,28.13 50.4,28.4 v52.1,28.4 | LPC1768.71 45.1,19.15 46.5,20.25 v46.5,21.25 | LPC1768.54 36.6,18.35 38,19.75 38,21.25 37.25,22 | 25.85,23.5 30.5,23.5 31.87,22.13 LPC1768.42 37.12,22.13 37.25,22 | R28.2 23.91,23.5 25.85,23.5 | 25.85,23.5 C7.1 | v46.5,23.4 47.5,23.4 | 33.2,29.1 34.5,29.1 34.75,28.85 34.75,28.5 35.15,28.1 37.4,28.1 38.5,27 38.5,23.25 37.25,22
  Top 0.406: MICRO_SD.4 3.34,35.41 v2.75,36 | v2.75,39 3.75,39.75 3.75,41.79 E-STOP.1
  Top 0.61: R18.1 R19.1 49.49,36.18 JTAG.1 43.93,41.49 | R2.1 R13.1 | L3.2 43.75,41.6
  Top 0.813: R17.2 R27.2 | R1.2 17.61,39.16 I2C.1 17.61,40.15 X-MAX.1 X-MIN.1 E-STOP.1 | ADC1.1 ADC0.1 56.04,36.01 R13.1 R18.1 | X1.11 62.44,39.18 INTERCONNECT.1 61.47,37.97 59.75,36.25 58.92,36.05 R2.1 | Z-MIN.1 Z-MAX.1
  Top 1.016: X1.1 X1.2 | X-MAX.1 25.17,42.58 | 25.17,42.58 28.87,42.58 Y-MIN.1 Y-MAX.1 | 25.17,42.58 24,43.75 24,46.46 R5.1 | R6.2 10.61,42.6 X-MIN.1 | Y-MAX.1 35.3,42.55 | L1.2 39.96,42.54 39.5,43 35.2,43 Y-MAX.1 | 4.25,42.75 2.75,42.75 2.25,43.5 2.25,52.75 2.75,53.5 4,53.5 6,55.5 6,58.5 6.75,59.25 11.25,59.25 13,57.5
  Bottom 0.254: v52.1,28.4 52.15,28.4 56,32.25 | v46.5,21.25 v46.5,23.4 | Q1.3 v2.75,36
  Bottom 0.406: v2.75,36 v2.75,39
  Bottom 1.016: X1.1 X1.11 68.83,48.43 70.69,50.29 70.94,55.15 69.39,57.7 66.47,57.7 B-AXIS.1 66.35,57.7 64.82,59.23 54.66,59.23 A-AXIS.1 53.01,57.83 51.61,59.23 41.33,59.23 Z-AXIS.1 39.55,57.58 37.9,59.23 27.99,59.23 Y-AXIS.1 24.69,59.23 14.66,59.23 X-AXIS.1
3V3_POL  (9 unrouted)
12V  (6 unrouted)
  Top 0.406: R14.1 13.75,9 15.75,7.5 17.49,7.5 J1.3 | C5.1 66.5,9.55 66.5,9.75
  Top 1.016: J3.5 54.78,7.02 61.45,7.02 61.55,7.11 62.11,7.11 C6.+ 66,7 67.25,5.75 67.5,5.75 | 51.26,10.54 51.26,10.79 | 51.26,10.79 J3.4 | J3.5 51.26,10.54 | 51.26,10.54 J3.3 52.15,9.27 52.53,8.89 J3.5 | 74.33,7.2 X1.10 | J3.5 52.53,9.53 50.63,9.53 48.09,6.99 39.32,6.99 J2.5 36.78,9.27 35.7,10.35 | 35.7,10.35 35.64,10.41 35.64,11.68 J2.4 | J1.4 20.53,10.54 20.59,10.48 | 20.59,10.48 J1.5 23.96,7.11 | J2.3 34.62,9.27 35.7,10.35 | 20.59,10.48 19.38,9.27 J1.3 19.25,9.3 19.38,9.14 | 47.32,7.11 47.58,7.11 51.26,10.79 | 51.26,10.79 51.13,10.79 50.75,11.18 50.75,11.05 49.86,10.16 | 63.07,7.11 54.94,7.11 54.44,7.62 | 61.55,6.6 60.53,6.6 61.04,6.1 58.5,6.1 | 58.5,6.1 54.44,6.1 52.06,8.47 | 52.06,8.47 51.39,9.14 50.88,9.14 48.34,6.6 | 45.29,6.6 38.18,6.6 37.67,7.11 | 48.34,6.6 45.29,6.6 | 37.67,7.11 35.13,9.65 35.64,9.65 38.18,7.11 | 53.42,6.6 54.44,6.6 | 48.34,6.6 53.42,6.6 | 53.42,6.6 53.93,6.1 45.8,6.1 45.29,6.6 | 31.07,6.6 37.16,6.6 37.67,7.11 | 37.67,7.11 36.66,7.11 34.62,9.14 | 51.71,8.13 50.37,8.13 | 51.71,8.13 51.9,8.13 | 51.39,11.18 52.4,10.16 52.4,9.91 | 52.4,9.91 52.4,9.65 | 49.36,7.11 54.44,7.11 54.94,6.6 | 20.4,9.65 20.91,9.65 23.45,7.11 24.46,7.11 24.97,6.6 24.97,6.36 31.07,6.36 | 31.07,6.36 31.58,6.6 | 31.07,6.36 35.64,7.11 | 35.64,7.11 36.15,7.11 | 35.64,7.11 34.12,8.64 34.12,8.13 33.61,7.62 | 22.43,6.1 23.45,6.1 | 23.45,6.1 45.29,6.1 | 19.38,9.14 22.43,6.1 | 19.38,9.14 19.38,8.13 21.42,6.1 22.43,6.1 | 23.45,6.1 20.4,9.14 | 35.13,9.14 34.12,9.14 33.14,8.16 | 33.14,8.16 32.08,7.11 | 67.5,5.75 70.5,5.75 71.75,7 | 71.75,7 73,8.5 75,8.5 75,7 74.25,6.25 72.5,6.25 70.75,4.5 60.1,4.5 58.5,6.1 | 59.75,5.5 66.75,5.5 | 70.25,5.5 71,5.5 73.75,8.25 73.75,7.5 73,6.75 71.5,6.75 70.25,5.5
  Top 1.016: 66.75,5.5 70.25,5.5 | 66.75,5.5 66,6.25 | 66,6.25 65.75,6.5 61.5,6.5 61,6 65.75,6 66,6.25 | 74.25,7.5 73,7.5 71.75,8.75 | 71.25,9.5 71.5,9 | 70.75,9.75 71.25,9.5 | 71.25,9.5 71.25,6 71.75,6.5 71.75,7 | 71.75,7 71.75,8.75 | 71.75,8.75 71.5,9 | 71.5,9 71.5,9.5 71.25,9.75 72,9.75 72.75,9 74.5,9 | 74.5,9 74.75,8.75 | 74.5,9 73.75,9.75 70.75,9.75 | 66.75,9.75 67.25,9.75 | 67.5,9.25 66.75,9.75 | 67.5,5.75 67.5,9.25 | 67.5,9.25 67.25,9.75 | 67.25,9.75 70.75,9.75 | 70.75,9.75 71.5,9 | 66.75,9.75 66.5,9.75 58,9.75 55.5,7.25 56.75,7.25 58.5,9 66,9 66,7.5 64.75,8.75 64.75,7.75 64,7 63,8 57.75,8 | 60.25,5.25 22.25,5.25 20.75,6.75 | 52.06,8.47 51.71,8.13 | 52.4,9.91 52.42,9.91 J3.5 | 33.26,8.04 33.14,8.16
  Top 1.27: 23.96,7.11 32.34,7.11 33.26,8.04 J2.3 | 66.75,5.5 66.75,8.5 | 66.75,8.5 66.75,9 | 66.75,8.5 65,6.75
A_DIR  (1 unrouted)
A_DIR_POL  (1 unrouted)
A_EN  (1 unrouted)
A_EN_POL  (1 unrouted)
A_STEP  (1 unrouted)
A_STEP_POL  (1 unrouted)
ADC0
  Top 0.2: ADC0.3 48.9,32.25 45.65,29 43.8,29 43.1,29.7 LPC1768.9
  Top 0.254: LPC1768.9
ADC1
  Top 0.254: LPC1768.8 43.6,34.05 44.3,34.75 44.75,34.75 45,35 45,35.75 45.25,36 48.5,36 50,34.5 ADC1.3
ATX_5V  (via drill 0.6)  (3 unrouted)
  Top 0.254: R8.1 22.36,46.47 arc45 22.54,46.54 22.95,47.35 26.8,47.35 arc-45 26.97,47.28 28.25,48.85 65.07,48.85 C9.+
  Top 0.813: v20.75,13.75 20.75,16.5 22.25,18 23.86,18 RS244.8
  Top 1.016: 74.32,24.57 X1.6 | 74.32,24.57 72.97,26.67 72.97,30.86 X1.4 73.79,33.72 72.83,35.17 72.83,48.15 R3.2 65.23,48.6 | 74.32,24.57 72.96,23.52 72.96,14.85 X1.19 | 21,15.25 20.75,15 v20.75,13.75
  Bottom 0.813: 68.75,7.75 65.5,5.5 26.25,5.5 26,5.25 14.5,5.25 12.5,7 12.5,14 14.25,16.5 16,16.5 17,15.5 17,15 18.25,13.75 v20.75,13.75
  Bottom 1.016: X1.20 X1.19
B_DIR  (1 unrouted)
B_DIR_POL  (1 unrouted)
B_EN  (1 unrouted)
B_EN_POL  (1 unrouted)
B_STEP  (1 unrouted)
B_STEP_POL  (1 unrouted)
BAR_INT
  Top 0.203: LPC1768.76 58.66,18.13 61.55,15.24 62.31,15.24 INTERCONNECT.19
CD_SD  (2 unrouted)
CL_INT
  Top 0.203: LPC1768.95 55.39,27.6 56.4,27.6 61.25,32.45 61.25,33.5 61.89,34.14 63.93,34.14 INTERCONNECT.6
CS_SD  (via drill 0.6)
  Top 0.254: MICRO_SD.2 5.54,33.21 6.25,32.5 6.25,28.5 v7.5,27.25 | v42.5,14.5 41.75,15.25 41.5,15.25 41.1,15.65 LPC1768.63
  Bottom 0.254: v7.5,27.25 12.25,22.5 16,22.5 17,21.5 17,19.5 19.5,17 22,17 23.9,15.1 39.15,15.1 41,13.25 42,13.25 42.5,13.75 v42.5,14.5
D4_INT
  Top 0.203: LPC1768.93 56.93,26.63 61.9,31.6 63.93,31.6 INTERCONNECT.8
D5_INT
  Top 0.203: LPC1768.90 59.25,25.13 62.06,27.94 62.31,27.94 INTERCONNECT.9
D6_INT
  Top 0.203: INTERCONNECT.10 64.98,28.07 64.09,29.06 61.67,29.06 58.37,25.65 48.88,25.65 LPC1768.91
D7_INT
  Top 0.203: INTERCONNECT.11 61.93,25.27 60.79,24.13 LPC1768.88
DEBUG_INT
  Top 0.203: INTERCONNECT.20 64.98,15.37 63.89,16.36 61.35,16.36 59.16,18.64 48.94,18.64 LPC1768.77
E-STOP  (1 unrouted)
  Top 0.254: R6.1 5.15,43.85 4.15,43.85 3.5,44.75 3.5,49.25 E-STOP.4
EN_INT
  Top 0.203: INTERCONNECT.4 64.98,35.69 64.19,36.68 61.65,36.68 61.04,36.07 61.04,34.79 60.25,34 60.25,33 56.7,29.62 48.84,29.62 LPC1768.99
FOO_INT
  Top 0.203: INTERCONNECT.7 62.18,30.35 57.99,26.16 48.88,26.16 LPC1768.92
GND  (via drill 0.6)  (18 unrouted)
  Top 0.2: 51.5,31 48.25,31 47.5,30.25 47.5,29
  Top 0.254: v71.35,11.75 74,14 75.5,14.04 75.79,14.04 76.5,14.75 76.5,18.75 X1.7 | ADC0.2 52.75,32.25 51.5,31 | 47.87,28.63 47.5,29 | 47.87,28.63 LPC1768.97 | C2.2 51.84,21.1 50.6,21.1 49.87,21.63 LPC1768.83 47.62,21.63 47,22.25 46.25,22.25 45.5,23 45.5,23.75 46.25,24.5 46.5,24.5 47,25 47,28.25 47.38,28.63 47.87,28.63 | 53,22.25 53.25,22.5 59,22.5 v59.75,21.75 | LPC1768.55 37.1,14.35 v37.1,14 | RESET_SW.3 25.81,31.69 26.25,31.25 27.3,31.25 C4.2 | 24.91,21.84 23.16,21.84 22.5,22.5 22.5,23.75 23.15,24.4 24.95,24.4 C7.2 25.87,25.23 27,24.1 30.8,24.1 32.27,22.63 LPC1768.41 37.13,22.63 38,23.5 38,26.75 37.12,27.63 LPC1768.31 33.32,27.6 28.9,27.6 v28,28.5 | LPC1768.72 45.6,15.5 47.1,14 47.1,13.72 47.33,13.5
  Top 0.406: RS244.5 24.91,21.84 26,20.75 26,17.41 R4.1
  Top 0.813: 41.75,41.5 v41.75,43.25 | MICRO_SD.MT1 0.71,42.46 v0.75,47.75 | X2.5 7.33,14.32 6.9,13.9 6.9,10.18 8.5,8.75 10.29,9 USB_UP.C 10.44,9.01 12V.C | MICRO_SD.CD1 13.14,39.11 v12.5,39.75
  Top 1.016: E-STOP.3 E-STOP.2 | X-MIN.2 X-MIN.3 | X-MAX.3 X-MAX.2 | Y-MIN.2 Y-MIN.3 | Y-MAX.3 Y-MAX.2 | Z-MAX.2 Z-MAX.3 | Z-MIN.3 Z-MIN.2 | MICRO_SD.MT2 1.06,35.25 | 1.06,35.25 1.06,40.06 MICRO_SD.MT1 | MICRO_SD.6 1.07,37.61 1.06,35.25 | 34.75,47.75 51.25,47.75 | 5V.C 23.89,51.45 3V.C 24.93,51.43 26.25,52.75 26.25,54.94 Y-AXIS.2 | ADC0.2 ADC1.2 | v45.25,37.55 46.05,37.55 R26.1 | L2.2 36.86,41.36 36,40.5 v32,40.5 27.5,40.5 27,41 21.76,41 I2C.2
  Top 1.27: EXT_POWER_SW.1 57.29,12.76 J3.8 | J3.8 56.34,10.54 J3.7 53.8,10.54 J3.6 J3.8 | J3.8 56.44,11.81 56.5,11.75 | 56.25,11.75 56.5,11.75 | 56.25,11.75 54.75,10.25 54.75,10.75 53.75,11.75 53.75,12.25 52.5,13.5 47.33,13.5 44.75,11 | J2.7 38.31,10.54 J2.6 40.69,11.81 41,11.5 40.25,11.5 39.25,10.5 39.25,11.25 38.75,11.75 | J2.8 40.85,10.54 J2.7 | J1.8 25.61,10.61 | 43.25,10.25 43.25,9 43.75,10 44,10.25 | 41,9 44.75,11 | 41,9 43,9 | 41,9 39.85,9 J2.7 | 24.25,9.75 24.25,10.5 25.5,11.75 22.94,11.81 J1.6 23.07,14.97 C15.2 R4.1 | J3.8 56.6,11.55 C6.- 62.53,12.97 62.25,13.25 | 62.25,13.25 57.75,13.25 56.25,11.75 | 56.5,11.75 57.5,11.75 | 57.5,11.75 58.25,12.5 62.25,12.5 | 57.5,11.75 56.25,10.5 56.5,10.5 57.5,11.5 66.75,11.5 66.5,11.25 57.25,11.25 55.5,9.5 55.5,10 58.25,12.75 66,12.75 66.75,12 | 66.75,12 66.75,11.25 | 66.75,12 66.75,13.25 65.75,13.25 | 62.25,13.25 65.75,13.25 | 62.25,13.25 62,13 66,13 67,14 | 67,14 68,14 | 67,14 67,17.5 | 67,17.5 67,18.54 X1.17 68.37,20.37 66.75,18.75 66.75,14.25 65.75,13.25 | 67,17.5 67.2,17.7 | 68,14 67.25,13.75 | 67.25,17.75 67.5,18 | 67.5,18 69.75,19.75 | 67.25,14.75 67.25,17.75 | 68,14 67.25,14.75 | 67.25,14.75 67.2,14.8 67.2,17.7 | 67.2,17.7 67.25,17.75 | 67.5,18 67.5,17.9 67.3,17.7 67.3,14.5 67.4,14.4 | X-AXIS.2 14.04,55.03 15,56 15,58.25 16,59.25 28.25,59.25 | 28.25,59.25 41.5,59.25 | 41.5,59.25 55,59.25 | 55,59.25 68.25,59.25 | 68.25,59.25 70,59.25 70.75,58.5 70.75,55.75 73.5,53 73.5,50.83 R3.1 | B-AXIS.2 66.38,55 66.75,55 68.25,56.5 68.25,59.25 | A-AXIS.2 53.05,55 53.5,55 55,56.5 55,59.25 | Z-AXIS.2 39.71,55 40,55 41.5,56.5 41.5,59.25 | Y-AXIS.2 26.38,55 26.75,55 28.25,56.5 28.25,59.25
  Top 1.27: E-STOP.3 X-MAX.3 | Y-MIN.3 Y-MAX.3 | Z-MAX.3 Z-MIN.3 | Z-MAX.2 57.98,46.09 C9.- | 41.75,11 40.75,11 | 44.75,11 41.75,11 | 44.75,11 44,10.25 | 44,10.25 43.25,10.25 | 43.25,10.25 41.25,10.25 41.25,11.5 | 41.25,11.5 41,11.75 | 41.75,11 41.25,11.5
  Top 1.778: 23,11.75 23,11 24.25,9.75 24.25,9.25
  Top 1.93: X1.17 X1.16 | 24.5,9.25 25.5,10.25 25.5,11.75
  Top 2.184: INTERCONNECT.2 68.53,37.97 X1.13 | X1.16 X1.15
  Bottom 0.254: POWER_SW.1 63.5,2 65,3.5 65.75,3.5 66.5,4.25 67,4.25 67.75,5 69.5,5 71.35,6.95 v71.35,11.75 | v45.25,37.55 46.77,37.55 JTAG.2 | v59.75,21.75 60,21.5 68.25,21.5 69.25,20.5 | 25.75,31.75 25.75,30.75 v28,28.5
  Bottom 0.813: C14.2 C13.2 | v41.75,43.25 43.25,44.75 v44.75,44.75 v44.75,47.5 | 30.75,14 31,14.25 26,14.25 25,13.25 | 38.75,14 40.75,12 | v0.75,47.75 4.38,47.75 | 15.32,19.57 PIEZO.- | 15.32,19.57 9.25,15 8.75,14.5 7.42,14.5 X2.5 | 15.32,19.57 15.32,19.43 19.25,15.5 21.57,15.5 23.07,14 J1.6 | v12.5,39.75 12.5,40 13.25,41.5 13.25,43.74 X-MIN.2
  Bottom 1.016: 4.38,47.75 E-STOP.3 | X-MAX.2 18.13,45.12 19.75,43.5 19.75,39.24 I2C.2 | C9.- 64.41,46.09 63.25,48 63.25,49.75 66.5,52.75 66.5,54.88 B-AXIS.2 | X-MAX.3 16.09,47.66 14.5,49.25 14.5,53.54 X-AXIS.2 | C14.2 32.83,39.67 v32,40.5
  Bottom 1.27: 26.86,13.61 J1.8 | 26.86,13.61 26.75,13 | 26.75,13 31.75,13 32.25,13.5 | 32.25,13.5 32.5,13.75 36.37,13.75 | 36.37,13.75 J2.6 | 36.37,13.75 37.75,13.75 | 37.75,13.75 39.5,12 | 37.75,13.75 39,13.75 | 39,13.75 40.75,12 40.75,10 39.75,9 39.5,9.25 | 39.5,9.25 38.25,10.5 38.25,11.75 39.75,10.25 39.75,10 40,10.25 40,11.75 38.25,13.5 32.25,13.5 | 26.75,13.5 24.5,10.75 | 26.75,13.5 26.86,13.61 | 24.5,10.75 24.5,9.5 26.75,13.5 | 24.5,10.75 24.5,11.25 25,11.75 | 25,11.75 25.25,11.75 | 25,11.75 23.25,11.75 24,12 | 24,12 24,11 | 26.75,13 27.5,13.75 | 27.5,13.75 29.25,13.75 | 29.25,13.75 32,13.75 32.25,14 v37.1,14 | 39,13.75 38.75,14 v37.1,14 | v37.1,14 30.75,14 30,13.25 29.75,13.25 29.25,13.75 | 27.5,13.75 25.75,13.75 24,12 | 39.5,9.25 43.5,9.25 47.75,13.5 | 47.75,13.5 52,13.5 | 52,13.5 52.5,13.5 54,12 53.5,12 52,13.5 | 47.75,13.5 47.25,13.5 44.5,10.75 | 44.5,10.75 43.75,10 41.25,10 41.25,10.75 44.5,10.75
  Bottom 1.93: 69.25,20.25 75,20.25 | 23,11.75 23,11 24.25,9.75 | 24.25,9.75 24.25,9.5 | 24.25,9.75 24.75,10.75 26.75,13.5
  Bottom 2.184: X1.13 X1.3 | INTERCONNECT.2 66.75,39.75 66.75,43.88 C9.-
  pour Top (no thermals): 108.75,40.75 106.5,62.75 77,60 77,0
  pour Bottom (no thermals): 98.75,17 100,52.25 77,60 77,0
GND_POL  (9 unrouted)
JTAG_TCK
  Top 0.254: R26.2 45.8,35.05 45.1,33.85 LPC1768.5
JTAG_TDI  (via drill 0.6)
  Top 0.254: LPC1768.2 46.6,30.85 v45.4,30
  Top 1.016: JTAG.5 R13.2
  Bottom 0.254: v45.4,30 47.75,32 48.85,32 49.5,32.65 49.5,34.6 51.25,36.6 52.25,36.5 53.75,38 54.84,38 JTAG.5
JTAG_TDO  (via drill 0.6)
  Top 0.254: LPC1768.1 47.1,31.85 47.65,31.9 v48.5,33
  Top 1.016: JTAG.4 R18.2
  Bottom 0.254: v48.5,33 48.9,34.8 51,37.25 52,37.25 53.5,38.75 53.5,39 53.55,39.25 JTAG.4
JTAG_TMS  (via drill 0.6)
  Top 0.254: LPC1768.3 46.1,32.95 47.5,33.25 v48.1,35
  Top 1.016: JTAG.6 R2.2
  Bottom 0.254: v48.1,35 50.75,38 51.5,38 52.5,39 52.5,40.25 53,40.75 57.37,40.75 JTAG.6
JTAG_TRST  (via drill 0.6)
  Top 0.254: LPC1768.4 45.6,33.15 v46.5,34
  Top 1.016: JTAG.3 R19.2
  Bottom 0.254: v46.5,34 46.5,34.74 JTAG.3
MISO_SD  (1 unrouted)
MOSI_SD  (via drill 0.6)
  Top 0.254: MICRO_SD.3 6.19,34.31 7.25,33.25 7.25,29.25 v9.25,27.25 | v41,14.5 40.5,14.5 39.6,15.4 LPC1768.60
  Bottom 0.254: v9.25,27.25 13,23.5 16.25,23.5 18,21.75 18,19.75 20,17.75 22.25,17.75 24.5,15.6 39.5,15.6 v41,14.5
N$1
  Top 0.813: 3V.A 24.06,48.2 arc45 24.13,48.28 R5.2
N$2
  Top 0.254: USB_UP.A 8.56,11.31 9.25,11.75 9.25,22.43 R9.2
N$3
  Top 0.813: R8.2 5V.A
N$4
  Bottom 0.254: EXT_POWER_SW.2 56,14.75 57,13.75 71.25,13.75 72.25,13.25 72.25,6.75 69.75,4.25 68.25,4.25 67.5,3.5 66.75,3.5 POWER_SW.2
N$10
  Top 0.61: 12V.A R14.2
N$20  (1 unrouted)
N$31
  Top 0.203: C8.1 40.73,35.55 41.61,34.67 LPC1768.12
  Top 1.016: L1.1 40.47,37.73 C10.1 C8.1
N$32
  Top 0.203: C8.2 38.94,35.81 40.09,34.42 40.09,31.9 LPC1768.15
  Top 1.016: L2.1 38.56,37.84 C10.2 C8.2
N$35
  Top 0.203: C11.1 44.03,36.06 42.62,34.41 42.62,31.9 LPC1768.10
  Top 1.016: C11.1 C12.1 43.84,38.07 L3.1
N$38
  Top 0.203: C11.2 42.04,35.27 42.12,34.54 42.12,31.9 LPC1768.11
  Top 1.016: C11.2 C12.2 42,37.98 L4.1
N$A6_POL  (1 unrouted)
N$B6_POL  (1 unrouted)
N$X6_POL  (1 unrouted)
N$Y6_POL  (1 unrouted)
N$Z6_POL  (1 unrouted)
OK_INT
  Top 0.203: LPC1768.94 56.67,27.13 62.56,33.02 62.31,33.02 INTERCONNECT.5
PIEZO  (via drill 0.6)
  Top 0.254: v28.5,10.25 30.75,13 42.5,13 43.6,14.1 LPC1768.68 arc-45 LPC1768.68
  Bottom 0.254: PIEZO.+ 15.45,8.75 18.1,6.55 25.35,6.55 v28.5,10.25
PWR_ON
  Bottom 0.254: POWER_SW.3 67.4,2.4 68.5,3.5 70,3.5 73,6.5 73,13.25 73.25,13.5 74.75,13.5 76.5,15 76.5,18.25 76.25,18.25 | X1.14 71.75,30.55 75.95,30.55 76.5,30 76.5,18.5 76.25,18.25 | EXT_POWER_SW.3 54,15 55.3,16.35 65.75,16.35 67.75,18.25 76.25,18.25
RESET~  (1 unrouted)
  Top 0.254: R28.1 23.9,26.9 24.25,27.25 25.73,27.25 RESET_SW.1
RS485_RX
  Top 0.203: LPC1768.47 31.9,19.63 30.31,18.03 RS244.1
RS485_TX
  Top 0.203: LPC1768.46 31.77,20.13 30.05,21.84 RS244.4
RS485A
  Top 0.203: J1.1 17.48,9.27 19.38,11.18 19.38,16.76 21.92,19.3 RS244.7
  Bottom 0.254: J1.1 17,8.99 17,8.5 18.5,7.25 25.2,7.25 27.75,11.25 31.75,11.25 32.02,10.77 J2.1 32,9.23 32,8.75 34,6.75 44,6.75 46.52,9.27 J3.1
RS485B
  Top 0.203: J1.2 17.99,16.38 21.92,20.32 23.64,20.32 RS244.6
  Bottom 0.254: J1.2 18,11.8 18,8.75 18.75,8 25,8 27.31,11.81 J2.2 33.23,8.77 34.5,7.5 43.5,7.5 47.75,11.75 48.66,11.75 J3.2
RS_INT
  Top 0.203: INTERCONNECT.3 60.75,33.75 60.75,32.75 57,29.18 48.9,29.18 LPC1768.98
RX_ENABLE  (1 unrouted)
  Top 0.203: LPC1768.48 32.29,19.13 30.43,17.27 27.77,17.27 27.26,17.78 27.26,18.67 27.77,19.18 | RS244.2 28.97,19.18
SCK_SD  (1 unrouted)
SCL3
  Top 0.254: R27.1 25.07,37.63 27.75,33.75 35,33.75 35.5,33.25 35.5,33.2 35.6,33.1 LPC1768.24
  Top 0.813: R27.1 I2C.4
SDA3
  Top 0.254: LPC1768.25 35.1,32.9 34.75,33.25 27.25,33.25 24.9,36.8 22.9,36.8 22.07,37.63 R17.1
  Top 0.813: R17.1 I2C.3
TX_ENABLE  (1 unrouted)
  Top 0.203: RS244.3 28.02,20.57 27.26,21.34 27.26,22.1 27.89,22.73 30.31,22.73 30.81,22.23 30.81,21.97 32.08,20.6 33.28,20.6 LPC1768.45
  Top 0.305: R4.2 26.15,15.4 26.75,16 26.75,19 27.25,21.25
USB_5V
  Bottom 0.254: X2.1 R7.2
USB_CONNECT  (1 unrouted)
USB_D+  (via drill 0.6)
  Top 0.254: R21.2 5.14,26 5.25,26.25 11.32,26.25 11.61,26.47 | 11.61,26.47 16.5,30.25 28.5,30.25 30.15,28.6 33.28,28.6 arc45 LPC1768.29 | 11.61,26.47 11.61,26.64 v11,27.25
  Bottom 0.254: Q1.2 10.8,27.55 v11,27.25
USB_D+_CON
  Top 0.254: R21.1 7.65,23.85 8,23.5 8,22.25 7.75,22 7.75,19 8.5,18.25 8.5,17.18 X2.3
USB_D-
  Top 0.254: R20.2 7.59,25.6 11.72,25.6 16.8,29.65 28.35,29.65 29.87,28.13 LPC1768.30
USB_D-_CON
  Top 0.254: R20.1 7,23 7.05,21.75 7.05,19.25 6,18.25 6,16.93 X2.2
USB_UP_LED
  Top 0.254: 33.87,27.1 33.28,27.1 arc45 LPC1768.32 27.62,27.13 26.15,28.95 17.2,28.95 12.05,24.85 9.7,24.85 9.11,24.36 R9.1
VBUS  (1 unrouted)
X+_INT
  Top 0.203: INTERCONNECT.12 64.72,25.27 63.58,26.52 61.42,26.52 59.64,24.64 LPC1768.89
X-_INT
  Top 0.203: INTERCONNECT.13 62.06,23.11 48.87,23.11 LPC1768.86
X_DIR  (1 unrouted)
X_DIR_POL  (1 unrouted)
X_EN  (1 unrouted)
X_EN_POL  (1 unrouted)
X_MAX  (1 unrouted)
X_MIN  (1 unrouted)
X_STEP  (1 unrouted)
X_STEP_POL  (1 unrouted)
XTAL1
  Top 0.254: LPC1768.22 36.6,34.85 12MHZ.1
  Bottom 0.254: C14.1 34.63,36.84 12MHZ.1
XTAL2
  Top 0.254: 12MHZ.2 29.8,36.7 31.5,35 34.6,35 36.1,33.5 LPC1768.23
  Bottom 0.254: C13.1 29.84,36.87 12MHZ.2
Y+_INT
  Top 0.203: LPC1768.87 61.3,23.63 61.55,23.98 63.83,23.98 INTERCONNECT.14
Y-_INT
  Top 0.203: INTERCONNECT.15 50.71,20.19 LPC1768.80
Y_DIR  (1 unrouted)
Y_DIR_POL  (1 unrouted)
Y_EN  (1 unrouted)
Y_EN_POL  (1 unrouted)
Y_MAX  (1 unrouted)
Y_MIN  (1 unrouted)
Y_STEP  (1 unrouted)
Y_STEP_POL  (1 unrouted)
Z+_INT
  Top 0.203: LPC1768.81 60.84,20.63 61.55,21.44 63.83,21.44 INTERCONNECT.16
Z-_INT
  Top 0.203: LPC1768.78 59.69,19.13 61.04,17.78 62.31,17.78 INTERCONNECT.17
Z_DIR  (1 unrouted)
Z_DIR_POL  (1 unrouted)
Z_EN  (1 unrouted)
Z_EN_POL  (1 unrouted)
Z_MAX  (1 unrouted)
Z_MIN  (1 unrouted)
Z_STEP  (1 unrouted)
Z_STEP_POL  (1 unrouted)
ZERO_INT
  Top 0.203: INTERCONNECT.18 64.72,17.65 63.48,18.9 61.7,18.9 60.91,19.68 48.91,19.68 LPC1768.79

### Text on the board
tPlace: PIEZO | Instructions: wiki.makerbot.com/mb2 | Design By: | NOT ETHERNET - THESE ARE RS485!!!!! | MakerBot.com | License: GPLv3 | c 2010 | MakerBot | MotherBoard | v2.4
_tsilk: [3V3] [GND] [TRST] [TDO] [TDI] [TMS] [TCK] | TXD0 | RXD0